# Altium schematic sheet MCU023_XDS110_Target_Interface.SchDoc
size 431 x 279 mm; Date: Not shown in title block; ApprovedBy: Not shown in title block; CheckedBy: Not shown in title block; Author: Not shown in title block; CompanyName: Not shown in title block; Engineer: Not shown in title block; Organization: Not shown in title block; Address1: Not shown in title block; Address2: Not shown in title block; Address3: Not shown in title block; Address4: Not shown in title block; DocumentNumber: 1; Revision: Use project parameter SCH_Rev; SheetNumber: 4; SheetTotal: 6; PageSetup: Record=PageOptions|CenterHorizontal=True|CenterVertical=True|PrintScale=1.00|XCorrection=1.00|YCorrection=1.00|PrintKind=0|BorderSize=5000000|LeftOffset=0|BottomOffset=0|Orientation=2|PaperLength=1000|PaperWidth=1000|Scale=100|PaperSource=15|PrintQuality=600|MediaType=1|DitherType=10|PaperKind=Letter|PrintScaleMode=1; CurrentTime: Not shown in title block; CurrentDate: Not shown in title block; Time: Not shown in title block; DocumentFullPathAndName: Not shown in title block; DocumentName: Not shown in title block; ModifiedDate: Not shown in title block; ImagePath: Not shown in title block
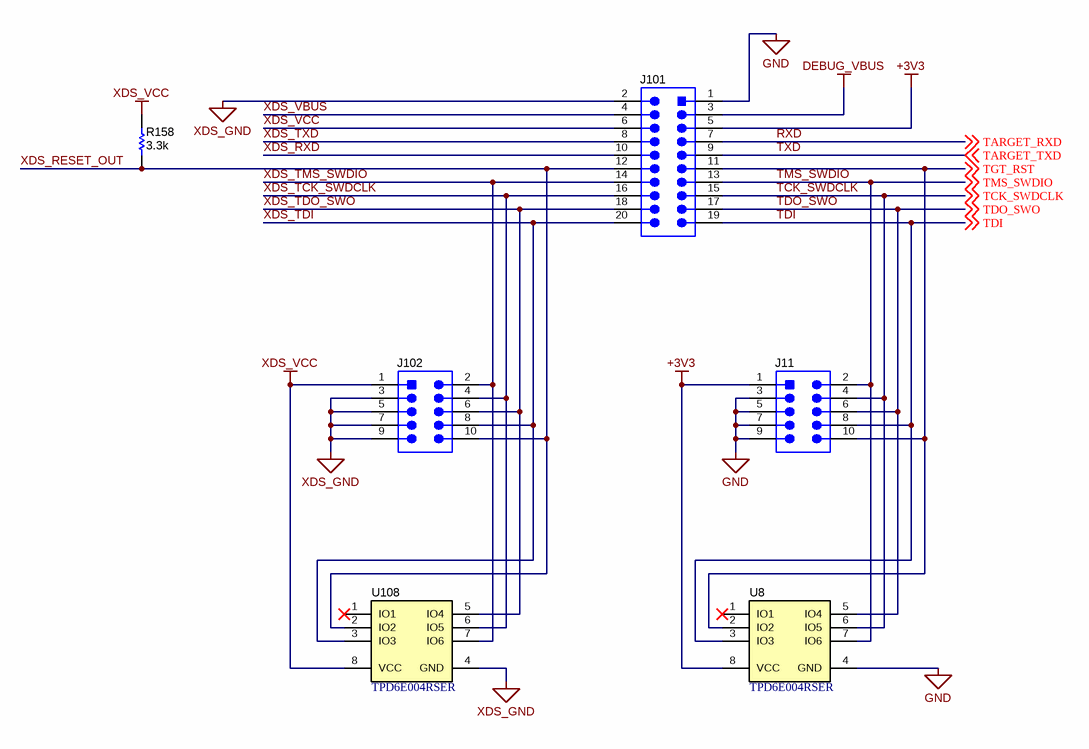
[diagram p0: MCU023_XDS110_Target_Interface.SchDoc]

## Parts
J11  FTSH-105-01-F-DV-K  [Samtec_FTSH-105-01-x-DV-K]  (value not drawn)
J101  PEC10DAAN  [SULLINS_PEC10DAAN]  (value not drawn)
J102  FTSH-105-01-F-DV-K  [Samtec_FTSH-105-01-x-DV-K]  (value not drawn)
R158  ValueDisplayed: 3.3k  [0402]  (hidden comment: CRCW04023K30JNED)
U8  TPD6E004RSER  [RSE0008A]
U108  TPD6E004RSER  [RSE0008A]

## Nets
+3V3: J11.1 J101.5 U8.8(VCC)
DEBUG_VBUS: J101.3
GND: J11.3 J11.5 J11.7 J11.9 J101.1 U8.4(GND)
XDS_GND: J101.2 J102.3 J102.5 J102.7 J102.9 U108.4(GND)
XDS_VCC: J101.6 J102.1 R158.2 U108.8(VCC)
RXD: J101.7 ; off-sheet TARGET_RXD  [also labelled TARGET_RXD]
TCK_SWDCLK: J11.4 J101.15 U8.6(IO5) ; off-sheet TCK_SWDCLK
TDI: J11.8 J101.19 U8.3(IO3) ; off-sheet TDI
TDO_SWO: J11.6 J101.17 U8.5(IO4) ; off-sheet TDO_SWO
TGT_RST: J11.10 J101.11 U8.2(IO2) ; off-sheet TGT_RST
TMS_SWDIO: J11.2 J101.13 U8.7(IO6) ; off-sheet TMS_SWDIO
TXD: J101.9 ; off-sheet TARGET_TXD  [also labelled TARGET_TXD]
XDS_RESET_OUT: J101.12 J102.10 R158.1 U108.2(IO2)
XDS_RXD: J101.10
XDS_TCK_SWDCLK: J101.16 J102.4 U108.6(IO5)
XDS_TDI: J101.20 J102.8 U108.3(IO3)
XDS_TDO_SWO: J101.18 J102.6 U108.5(IO4)
XDS_TMS_SWDIO: J101.14 J102.2 U108.7(IO6)
XDS_TXD: J101.8
XDS_VBUS: J101.4

Not connected (* = marked no-connect by the designer): U8 1(IO1)*; U108 1(IO1)*

## Notes on the sheet
- Drawn By:
- SVN Rev:
- Number:
- TID #:
- Orderable:
- Rev:
- Sheet Title:
- File:
- Project Title:
- Designed for:
- Assembly Variant:
- Mod. Date:
- Sheet:
- Size:
- of
- B
- http://www.ti.com
- Texas Instruments and/or its licensors do not warrant the accuracy or completeness of this specification or any information contained therein. Texas Instruments and/or its licensors do not warrant that this design will meet the specifications, will be suitable for your application or fit for any particular purpose, or will operate in an implementation. Texas Instruments and/or its licensors do not warrant that the design is production worthy. You should completely validate and test your design implementation to confirm the system functionality for your application.
- Engineer:
- Contact:
- © Texas Instruments

## Library data of the parts
J11 J102 = FTSH-105-01-F-DV-K: Header (Shrouded), 1.27mm, 5x2, Gold, SMT; Manufacturer: Samtec; SymbolCreator: a0412235; Pitch_mm: 1.27; Gender: Male; Shrouded: Y; Row_Count: 2; Current_A: 3.3; SymbolVersion: 2013-12-22; PartNumber: FTSH-105-01-F-DV-K; PackageReference: Header(Shrouded), 1.27mm, 5x2, SMT; CompType: Header; RoHS: Y; MountType: SMT; ComponentLink1Description: Datasheet URL; ComponentLink1URL: http://suddendocs.samtec.com/prints/ftsh-1xx-xx-xxx-dv-xxx-mkt.pdf; Orientation: Vertical; PinCount: 10; RowSpacing_mm: 1.27; ContactFinish: Gold; Color: Black; Cert_CSA: Y; Cert_UL: Y; Publisher: Texas Instruments; LatestRevisionDate: 2016-12-09; Supplier 1: Digi-Key; Supplier Part Number 1: SAM8796-ND
J101 = PEC10DAAN: Header, 2.54mm, 10x2, Tin, TH; Manufacturer: Sullins Connector Solutions; SymbolCreator: a0412235; Pitch_mm: 2.54; Gender: Male; Shrouded: N; Row_Count: 2; Current_A: 3; Cert_UL: Y; Green_Lifecycle: Not Set; Green_REACh: Incomplete; SymbolVersion: 2013-09-12; PartNumber: PEC10DAAN; PackageReference: Header, 10x2, 2.54mm, TH; ClassName: Header; CompType: Header; RoHS: Y; MountType: TH; ComponentLink1Description: Datasheet URL; ComponentLink1URL: https://drawings-pdf.s3.amazonaws.com/C10419.pdf; Orientation: Vertical; PinCount: 20; RowSpacing_mm: 2.54; ContactFinish: Tin; Color: Black; Publisher: Texas Instruments; LatestRevisionDate: 2017-05-05; Supplier 1: Digi-Key; Supplier Part Number 1: S2012E-10-ND; Green_EU RoHS: Incomplete; Green_EU RoHS-2: Incomplete
R158 = CRCW04023K30JNED: RES, 3.3 k, 5%, 0.063 W, 0402; Manufacturer: Vishay-Dale; CompType: Resistor; Value: 3.3k; Res_ohm: 3300; Value_Code: 3k30; Tolerance_%: 5; Power_W: 0.063; Value2: 0.063W; VDC_V: 50; TempCo: 200 ppm/C; SizeArea_mm2: 0.5; SizeX_mm: 1; SizeZ_mm: 0.6; EIA_Code: E24; U/M: EA; AEC Category: Q200; SymbolVersion: 2009-05-29; PartNumber: CRCW04023K30JNED; PackageReference: 0402; RoHS: Y; Value1: 5%; MountType: SMT; Technology: Thick Film; SizeY_mm: 0.5; Published: 2008-06-26; Publisher: Texas Instruments; LatestRevisionDate: 2017-04-13; ComponentLink1Description: Datasheet link; ComponentLink1URL: http://www.vishay.com/docs/20035/dcrcwe3.pdf; Supplier 1: Digi-Key; Supplier Part Number 1: 541-3.3KJCT-ND; Supplier 2: Newark; Supplier Part Number 2: 59M6723; Supplier 3: Mouser; Supplier Part Number 3: 71-CRCW0402J-3.3K-E3; AEC Qualified: ?
U8 U108 = TPD6E004RSER: Low-Capacitance + / - 15 kV ESD Protection Array for High-Speed Data Interfaces, 6 Channels, -40 to +85 degC, 8-pin UQFN (RSE), Green (RoHS & no Sb/Br); Manufacturer: Texas Instruments; Alternate PartNumber: Equivalent; 1394 / Firewire: TRUE; Breakdown Voltage(Min)(V): 6; IEC 61000-4-2 Air-Gap(+/- kV): 12; IEC 61000-4-2 Contact(+/- kV): 8; IO Capacitance(Typ)(pF): 1.6; IO Leakage Current(nA): 1; SubFamily: ESD Solution; Note: TI Supplied; DatasheetVersion: SLLS799A; PackageVersion: revD, Jan-2011; PackageReference: RSE0008A; PackageDescription: 8-Pin Plastic Quad Flatpack No-Lead, 1.5 x 1.5 mm Body, 0.5 mm Pitch; Supplier 1: Digi-Key; Supplier Part Number 1: 296-23619-2-ND; Supplier 2: Digi-Key; Supplier Part Number 2: 296-23619-1-ND; Supplier 3: Digi-Key; Supplier Part Number 3: 296-23619-6-ND; Supplier 4: Farnell; Supplier Part Number 4: 1755333; Supplier 5: Newark; Supplier Part Number 5: 85M0178; Supplier 6: Mouser; Supplier Part Number 6: 595-TPD6E004RSER; Eco-Plan: Green (RoHS & no Sb/Br); Serial ATA / eSATA: TRUE; USB High Speed: TRUE; MountType: SMT; Code_JEDEC: MO-288; PartNumber: TPD6E004RSER; ComponentLink1Description: Datasheet; ComponentLink1URL: http://www.ti.com/general/docs/lit/getliterature.tsp?genericPartNumber=TPD6E004&fileType=pdf; ComponentLink2Description: URL Link1; ComponentLink2URL: SamplesURL:http://www.ti.com/product/tpd6e004#samples; Alternate Manufacturer: Texas Instruments